# Altium schematic sheet P_IN.SchDoc
size C; DocumentNumber: 3; SheetNumber: 3; SheetTotal: 9
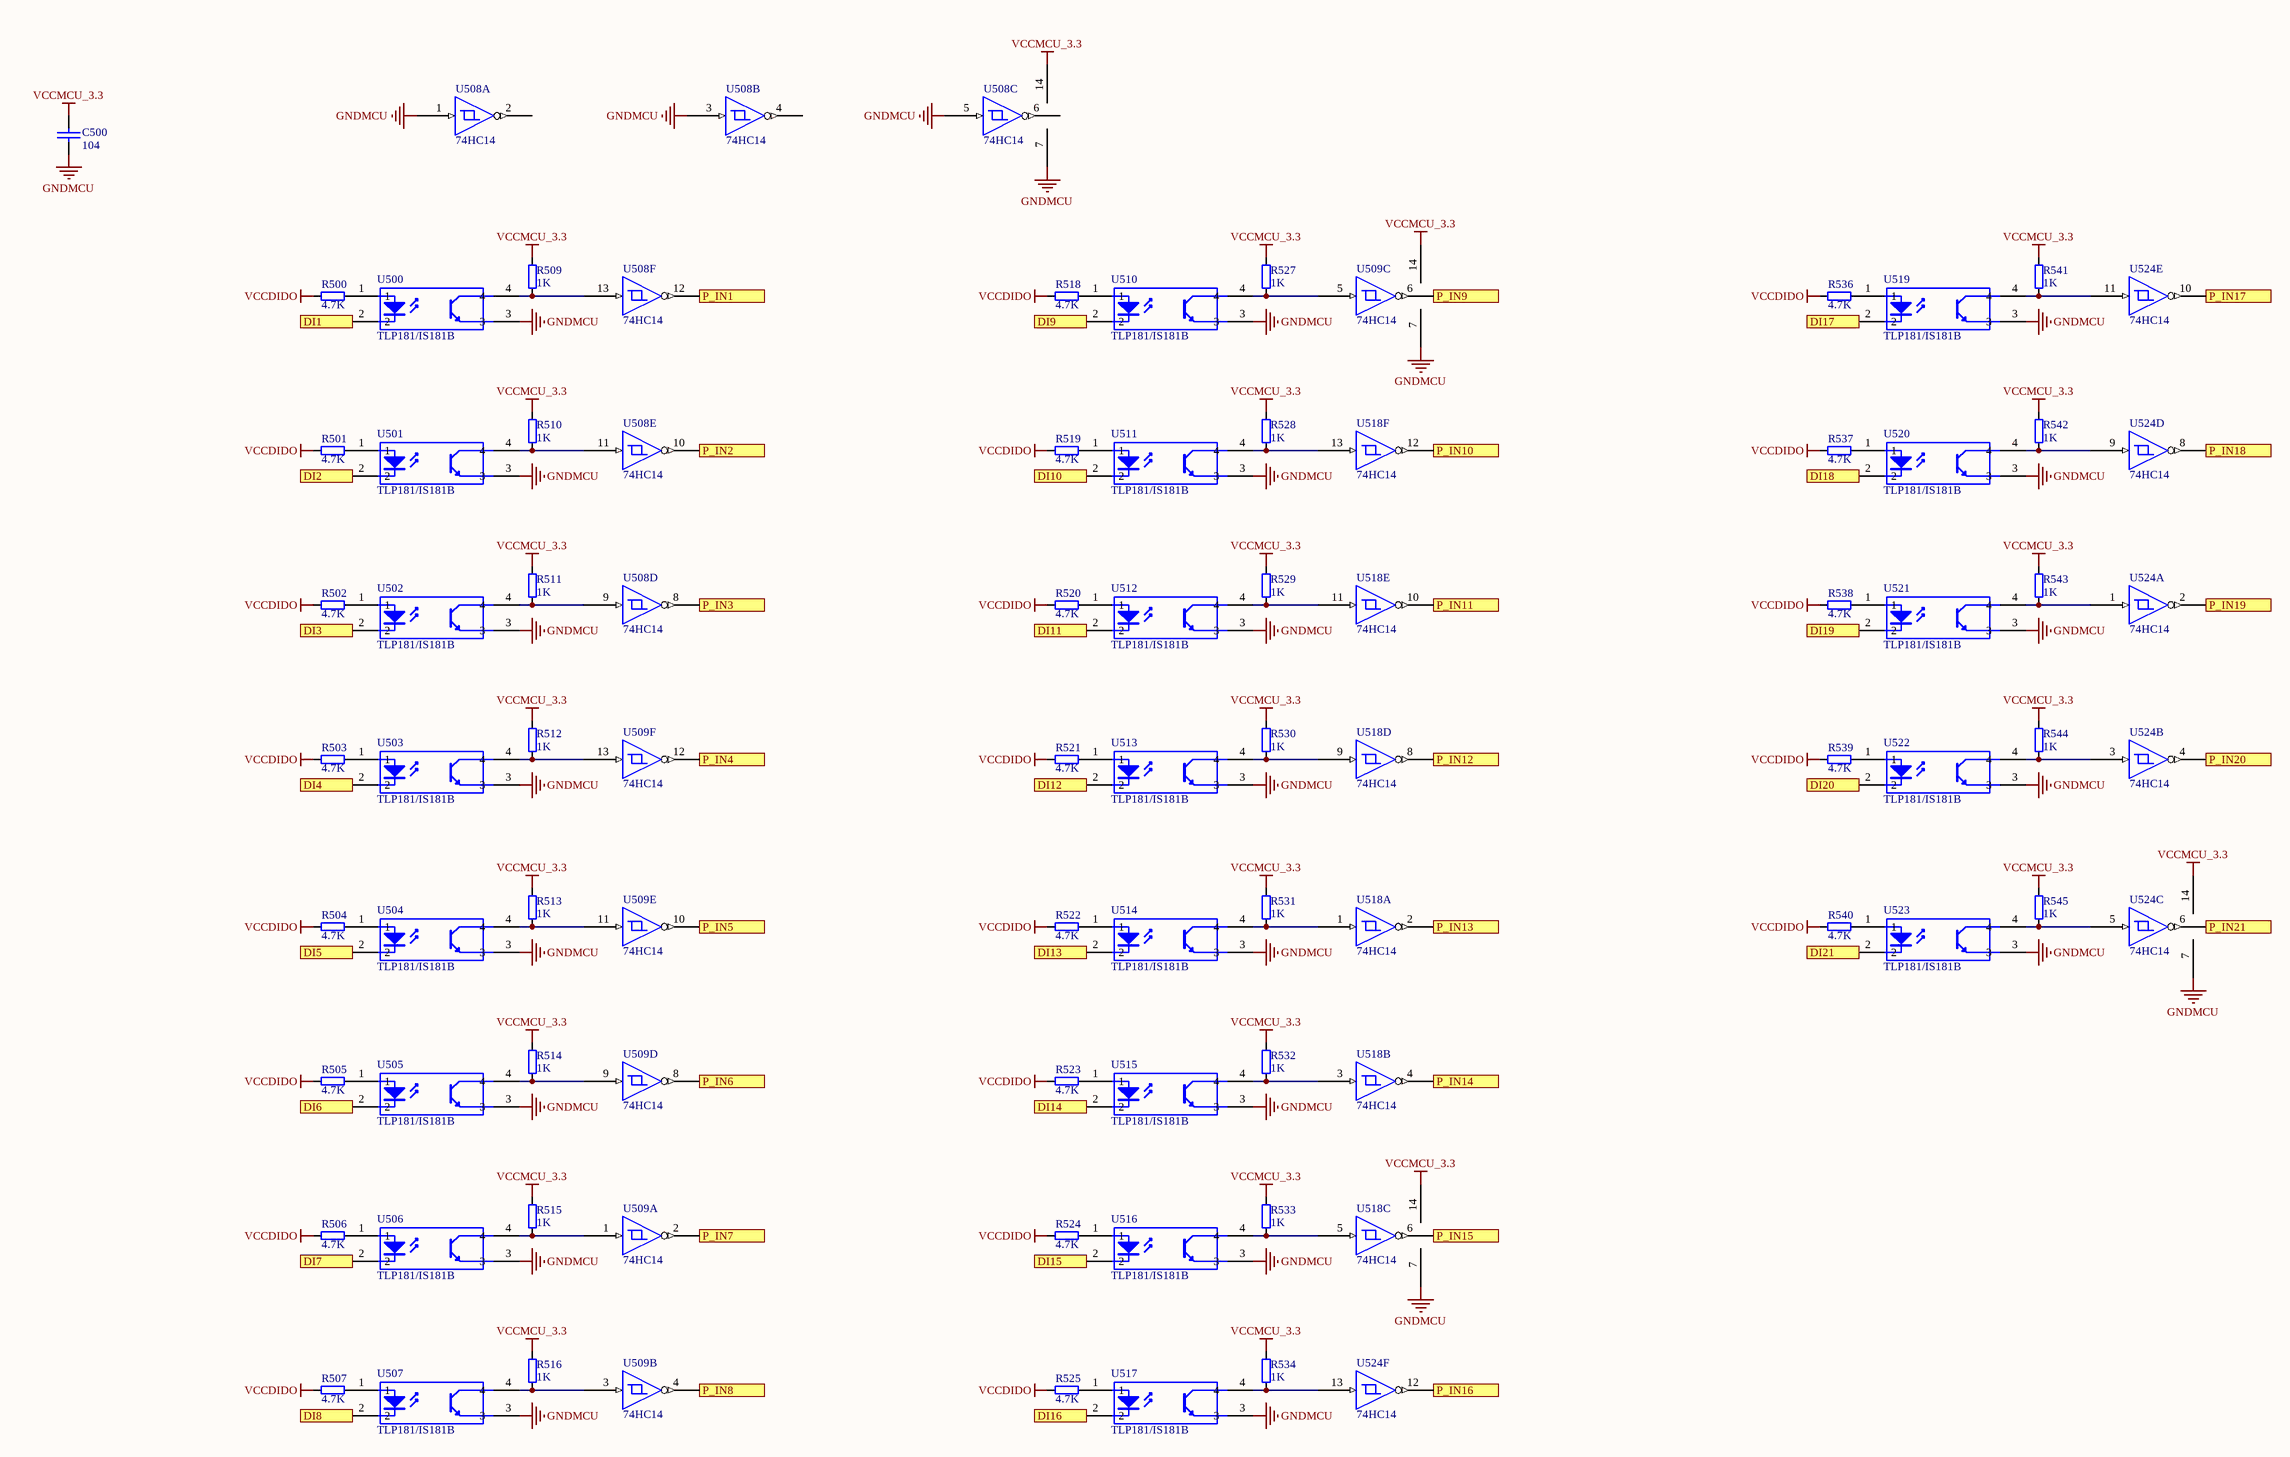
[diagram p0: P_IN.SchDoc]

## Parts
C500  104  [CAPC_E0805_2012X70N]
R500  4.7K  [RESC_E0805_2012X50N]
R501  4.7K  [RESC_E0805_2012X50N]
R502  4.7K  [RESC_E0805_2012X50N]
R503  4.7K  [RESC_E0805_2012X50N]
R504  4.7K  [RESC_E0805_2012X50N]
R505  4.7K  [RESC_E0805_2012X50N]
R506  4.7K  [RESC_E0805_2012X50N]
R507  4.7K  [RESC_E0805_2012X50N]
R509  1K  [RESC_E0805_2012X50N]
R510  1K  [RESC_E0805_2012X50N]
R511  1K  [RESC_E0805_2012X50N]
R512  1K  [RESC_E0805_2012X50N]
R513  1K  [RESC_E0805_2012X50N]
R514  1K  [RESC_E0805_2012X50N]
R515  1K  [RESC_E0805_2012X50N]
R516  1K  [RESC_E0805_2012X50N]
R518  4.7K  [RESC_E0805_2012X50N]
R519  4.7K  [RESC_E0805_2012X50N]
R520  4.7K  [RESC_E0805_2012X50N]
R521  4.7K  [RESC_E0805_2012X50N]
R522  4.7K  [RESC_E0805_2012X50N]
R523  4.7K  [RESC_E0805_2012X50N]
R524  4.7K  [RESC_E0805_2012X50N]
R525  4.7K  [RESC_E0805_2012X50N]
R527  1K  [RESC_E0805_2012X50N]
R528  1K  [RESC_E0805_2012X50N]
R529  1K  [RESC_E0805_2012X50N]
R530  1K  [RESC_E0805_2012X50N]
R531  1K  [RESC_E0805_2012X50N]
R532  1K  [RESC_E0805_2012X50N]
R533  1K  [RESC_E0805_2012X50N]
R534  1K  [RESC_E0805_2012X50N]
R536  4.7K  [RESC_E0805_2012X50N]
R537  4.7K  [RESC_E0805_2012X50N]
R538  4.7K  [RESC_E0805_2012X50N]
R539  4.7K  [RESC_E0805_2012X50N]
R540  4.7K  [RESC_E0805_2012X50N]
R541  1K  [RESC_E0805_2012X50N]
R542  1K  [RESC_E0805_2012X50N]
R543  1K  [RESC_E0805_2012X50N]
R544  1K  [RESC_E0805_2012X50N]
R545  1K  [RESC_E0805_2012X50N]
U500  TLP181/IS181B  [TLP181]
U501  TLP181/IS181B  [TLP181]
U502  TLP181/IS181B  [TLP181]
U503  TLP181/IS181B  [TLP181]
U504  TLP181/IS181B  [TLP181]
U505  TLP181/IS181B  [TLP181]
U506  TLP181/IS181B  [TLP181]
U507  TLP181/IS181B  [TLP181]
U508  74HC14  [SO-14]  (parts A,B,C,D,E,F of 6)
U509  74HC14  [SO-14]  (parts A,B,C,D,E,F of 6)
U510  TLP181/IS181B  [TLP181]
U511  TLP181/IS181B  [TLP181]
U512  TLP181/IS181B  [TLP181]
U513  TLP181/IS181B  [TLP181]
U514  TLP181/IS181B  [TLP181]
U515  TLP181/IS181B  [TLP181]
U516  TLP181/IS181B  [TLP181]
U517  TLP181/IS181B  [TLP181]
U518  74HC14  [SO-14]  (parts A,B,C,D,E,F of 6)
U519  TLP181/IS181B  [TLP181]
U520  TLP181/IS181B  [TLP181]
U521  TLP181/IS181B  [TLP181]
U522  TLP181/IS181B  [TLP181]
U523  TLP181/IS181B  [TLP181]
U524  74HC14  [SO-14]  (parts A,B,C,D,E,F of 6)

## Ports
DI1 (in), DI2 (in), DI3 (in), DI4 (in), DI5 (in), DI6 (in), DI7 (in), DI8 (in), DI9 (in), DI10 (in), DI11 (in), DI12 (in), DI13 (in), DI14 (in), DI15 (in), DI16 (in), DI17 (in), DI18 (in), DI19 (in), DI20 (in), DI21 (in), P_IN1 (out), P_IN2 (out), P_IN3 (out), P_IN4 (out), P_IN5 (out), P_IN6 (out), P_IN7 (out), P_IN8 (out), P_IN9 (out), P_IN10 (out), P_IN11 (out), P_IN12 (out), P_IN13 (out), P_IN14 (out), P_IN15 (out), P_IN16 (out), P_IN17 (out), P_IN18 (out), P_IN19 (out), P_IN20 (out), P_IN21 (out)

## Nets
GNDMCU: C500.2 U500.3 U501.3 U502.3 U503.3 U504.3 U505.3 U506.3 U507.3 U508.1 U508.3 U508.5 U508.7 U509.7 U510.3 U511.3 U512.3 U513.3 U514.3 U515.3 U516.3 U517.3 U518.7 U519.3 U520.3 U521.3 U522.3 U523.3 U524.7
VCCDIDO: R500.2 R501.2 R502.2 R503.2 R504.2 R505.2 R506.2 R507.2 R518.2 R519.2 R520.2 R521.2 R522.2 R523.2 R524.2 R525.2 R536.2 R537.2 R538.2 R539.2 R540.2
VCCMCU_3.3: C500.1 R509.2 R510.2 R511.2 R512.2 R513.2 R514.2 R515.2 R516.2 R527.2 R528.2 R529.2 R530.2 R531.2 R532.2 R533.2 R534.2 R541.2 R542.2 R543.2 R544.2 R545.2 U508.14 U509.14 U518.14 U524.14
DI1: U500.2 ; port DI1
DI2: U501.2 ; port DI2
DI3: U502.2 ; port DI3
DI4: U503.2 ; port DI4
DI5: U504.2 ; port DI5
DI6: U505.2 ; port DI6
DI7: U506.2 ; port DI7
DI8: U507.2 ; port DI8
DI9: U510.2 ; port DI9
DI10: U511.2 ; port DI10
DI11: U512.2 ; port DI11
DI12: U513.2 ; port DI12
DI13: U514.2 ; port DI13
DI14: U515.2 ; port DI14
DI15: U516.2 ; port DI15
DI16: U517.2 ; port DI16
DI17: U519.2 ; port DI17
DI18: U520.2 ; port DI18
DI19: U521.2 ; port DI19
DI20: U522.2 ; port DI20
DI21: U523.2 ; port DI21
P_IN1: U508.12 ; port P_IN1
P_IN2: U508.10 ; port P_IN2
P_IN3: U508.8 ; port P_IN3
P_IN4: U509.12 ; port P_IN4
P_IN5: U509.10 ; port P_IN5
P_IN6: U509.8 ; port P_IN6
P_IN7: U509.2 ; port P_IN7
P_IN8: U509.4 ; port P_IN8
P_IN9: U509.6 ; port P_IN9
P_IN10: U518.12 ; port P_IN10
P_IN11: U518.10 ; port P_IN11
P_IN12: U518.8 ; port P_IN12
P_IN13: U518.2 ; port P_IN13
P_IN14: U518.4 ; port P_IN14
P_IN15: U518.6 ; port P_IN15
P_IN16: U524.12 ; port P_IN16
P_IN17: U524.10 ; port P_IN17
P_IN18: U524.8 ; port P_IN18
P_IN19: U524.2 ; port P_IN19
P_IN20: U524.4 ; port P_IN20
P_IN21: U524.6 ; port P_IN21
NetR500_1: R500.1 U500.1
NetR501_1: R501.1 U501.1
NetR502_1: R502.1 U502.1
NetR503_1: R503.1 U503.1
NetR504_1: R504.1 U504.1
NetR505_1: R505.1 U505.1
NetR506_1: R506.1 U506.1
NetR507_1: R507.1 U507.1
NetR509_1: R509.1 U500.4 U508.13
NetR510_1: R510.1 U501.4 U508.11
NetR511_1: R511.1 U502.4 U508.9
NetR512_1: R512.1 U503.4 U509.13
NetR513_1: R513.1 U504.4 U509.11
NetR514_1: R514.1 U505.4 U509.9
NetR515_1: R515.1 U506.4 U509.1
NetR516_1: R516.1 U507.4 U509.3
NetR518_1: R518.1 U510.1
NetR519_1: R519.1 U511.1
NetR520_1: R520.1 U512.1
NetR521_1: R521.1 U513.1
NetR522_1: R522.1 U514.1
NetR523_1: R523.1 U515.1
NetR524_1: R524.1 U516.1
NetR525_1: R525.1 U517.1
NetR527_1: R527.1 U509.5 U510.4
NetR528_1: R528.1 U511.4 U518.13
NetR529_1: R529.1 U512.4 U518.11
NetR530_1: R530.1 U513.4 U518.9
NetR531_1: R531.1 U514.4 U518.1
NetR532_1: R532.1 U515.4 U518.3
NetR533_1: R533.1 U516.4 U518.5
NetR534_1: R534.1 U517.4 U524.13
NetR536_1: R536.1 U519.1
NetR537_1: R537.1 U520.1
NetR538_1: R538.1 U521.1
NetR539_1: R539.1 U522.1
NetR540_1: R540.1 U523.1
NetR541_1: R541.1 U519.4 U524.11
NetR542_1: R542.1 U520.4 U524.9
NetR543_1: R543.1 U521.4 U524.1
NetR544_1: R544.1 U522.4 U524.3
NetR545_1: R545.1 U523.4 U524.5

Not connected (* = marked no-connect by the designer): U508 2 4 6

## Library data of the parts
C500 = CAP: Capacitor
R500-R507 R509-R516 R518-R525 R527-R534 R536-R545 = Res: General Resistor; Postscript: 16V, 5%; Package: 0805; Mounting Type: 表面贴装; Type: Resistor
U500-U507 U510-U517 U519-U523 = TLP181: 光耦隔离
U508 U509 U518 U524 = 74LS14